# Altium schematic sheet HMI.SchDoc: Témoins et boutons
size Letter; Organization: Robocup Ulaval; DocumentNumber: 7; Revision: 1.0; SheetNumber: 7; SheetTotal: 10; Version: Gamma 1.0; Conceptor: Philippe T. Simon B. Léonard G. Alexia B-L.
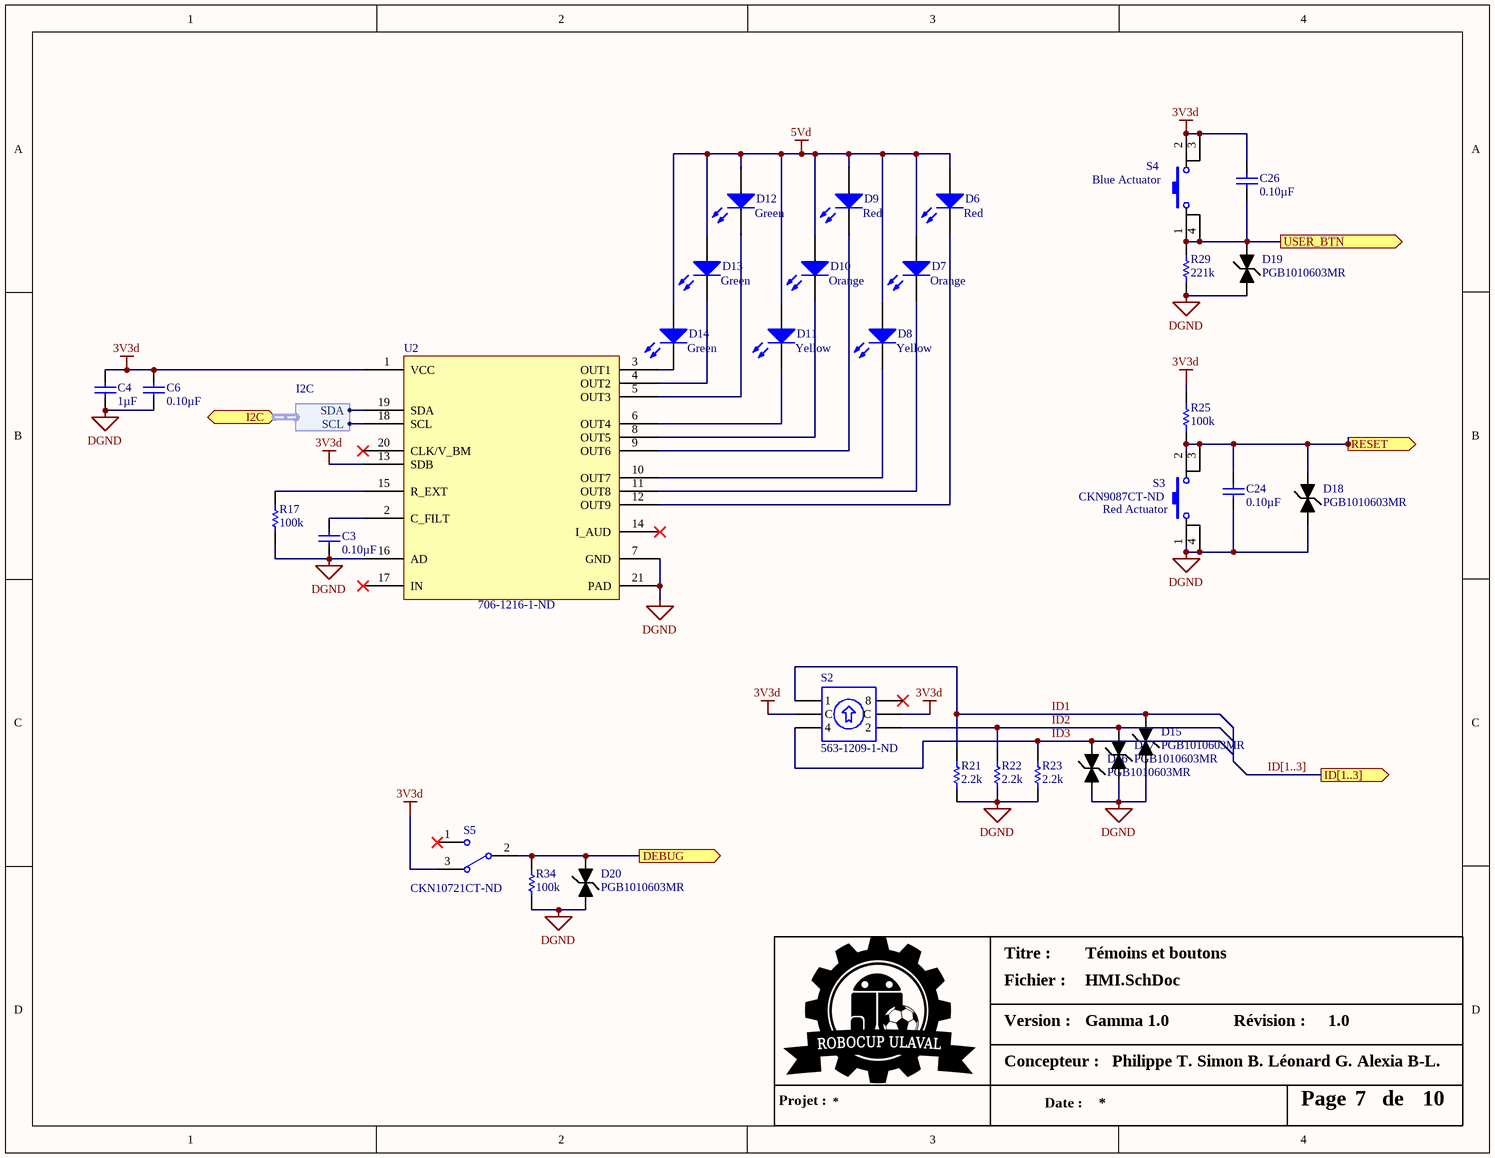
[diagram p0: HMI.SchDoc]

## Parts
C3  Capacitance: 0.10µF  [0603]  (hidden comment: CL10B104KB8SFNC)
C4  Capacitance: 1µF  [0805]  (hidden comment: CL21B105KBFNFNE)
C6  Capacitance: 0.10µF  [0603]  (hidden comment: CL10B104KB8SFNC)
C24  Capacitance: 0.10µF  [0603]  (hidden comment: CL10B104KB8SFNC)
C26  Capacitance: 0.10µF  [0603]  (hidden comment: CL10B104KB8SFNC)
D6  Color: Red  [0805]  (hidden comment: LH R974-LP-1)
D7  Color: Orange  [0805]  (hidden comment: AA1112H-TR)
D8  Color: Yellow  [0805]  (hidden comment: LY R976-PS-36)
D9  Color: Red  [0805]  (hidden comment: LH R974-LP-1)
D10  Color: Orange  [0805]  (hidden comment: AA1112H-TR)
D11  Color: Yellow  [0805]  (hidden comment: LY R976-PS-36)
D12  Color: Green  [0805]  (hidden comment: LG R971-KN-1)
D13  Color: Green  [0805]  (hidden comment: LG R971-KN-1)
D14  Color: Green  [0805]  (hidden comment: LG R971-KN-1)
D15  PGB1010603MR  [0603]
D16  PGB1010603MR  [0603]
D17  PGB1010603MR  [0603]
D18  PGB1010603MR  [0603]
D19  PGB1010603MR  [0603]
D20  PGB1010603MR  [0603]
R17  Resistance (Ohms): 100k  [0603]  (hidden comment: RC0603JR-07100KL)
R21  Resistance (Ohms): 2.2k  [0603]  (hidden comment: RC0603FR-072K2L)
R22  Resistance (Ohms): 2.2k  [0603]  (hidden comment: RC0603FR-072K2L)
R23  Resistance (Ohms): 2.2k  [0603]  (hidden comment: RC0603FR-072K2L)
R25  Resistance (Ohms): 100k  [0603]  (hidden comment: RC0603JR-07100KL)
R29  Resistance (Ohms): 221k  [0603]  (hidden comment: RC0603FR-07221KL)
R34  Resistance (Ohms): 100k  [0603]  (hidden comment: RC0603JR-07100KL)
S2  Supplier Part Number 1: 563-1209-1-ND  [RotarySwitch]  (hidden comment: SH-7010TB)
S3  Supplier Part Number 1: CKN9087CT-ND  Features: Red Actuator  [6 mm Tact Switches]  (hidden comment: PTS645SK50SMTR92 LFS)
S4  Features: Blue Actuator  [6 mm Tact Switches]  (hidden comment: PTS645SM43SMTR92 LFS)
S5  Supplier Part Number 1: CKN10721CT-ND  [SPDT-SW]  (hidden comment: JS102011JCQN)
U2  Supplier Part Number 1: 706-1216-1-ND  [QFN40P300X300X80_HS-21N]  (hidden comment: IS31FL3199-QFLS2-TR)

## Ports
DEBUG (out), I2C (harness I2C), ID[1..3] (out), RESET (out), USER_BTN (out)

## Harnesses
I2C: SCL, SDA

## Nets
3V3d: C4.2 C6.2 C26.2 R25.2 S2.2(C) S2.5(C) S4.2 S4.3 S5.3 U2.1(VCC) U2.13(SDB)
5Vd: D6.1(A) D7.1(A) D8.1(A) D9.1(A) D10.1(A) D11.1(A) D12.1(A) D13.1(A) D14.1(A)
DGND: C3.1 C4.1 C6.1 C24.1 D15.1 D16.1 D17.1 D18.1 D19.1 D20.1 R17.1 R21.1 R22.1 R23.1 R29.1 R34.1 S3.1 S3.4 U2.7(GND) U2.16(AD) U2.21(PAD)
DEBUG: D20.2 R34.2 S5.2 ; port DEBUG
ID1: D15.2 R21.2 S2.1
ID2: D17.2 R22.2 S2.4(2)
ID3: D16.2 R23.2 S2.3(4)
RESET: C24.2 D18.2 R25.1 S3.2 S3.3 ; port RESET
USER_BTN: C26.1 D19.2 R29.2 S4.1 S4.4 ; port USER_BTN
NetC3_2: C3.2 U2.2(C_FILT)
NetD6_2: D6.2(K) U2.12(OUT9)
NetD7_2: D7.2(K) U2.11(OUT8)
NetD8_2: D8.2(K) U2.10(OUT7)
NetD9_2: D9.2(K) U2.9(OUT6)
NetD10_2: D10.2(K) U2.8(OUT5)
NetD11_2: D11.2(K) U2.6(OUT4)
NetD12_2: D12.2(K) U2.5(OUT3)
NetD13_2: D13.2(K) U2.4(OUT2)
NetD14_2: D14.2(K) U2.3(OUT1)
NetR17_2: R17.2 U2.15(R_EXT)
NetU2_18: U2.18(SCL) ; port I2C.SCL
NetU2_19: U2.19(SDA) ; port I2C.SDA

Not connected (* = marked no-connect by the designer): S2 6(8)*; S5 1*; U2 14(I_AUD)* 17(IN)* 20(CLK/V_BM)*

## Buses and harness runs
bus ID[1..3] = port ID[1..3]

## Notes on the sheet
- Titre :
- Version :
- Fichier :
- Révision :
- Projet :
- Concepteur :
- Date :
- Page
- de

## Library data of the parts
C3 C6 C24 C26 = CL10B104KB8SFNC: CAP CER 0.1UF 50V X7R 0603; Manufacturer: Samsung Electro-Mechanics America, Inc.; Tolerance: ±10%; Supplier 1: Digi-Key; Manufacturer Part Number: CL10B104KB8SFNC; RoHS: RoHS Compliant; Category: Capacitors; Packaging: Cut Tape (CT); Voltage - Rated: 50V; Temperature Coefficient: X7R; Mounting Type: Surface Mount, MLCC; Operating Temperature: -55°C ~ 125°C; Applications: Boardflex Sensitive; Ratings: -; Package / Case: 0603 (1608 Metric); Size / Dimension: 0.063" L x 0.031" W (1.60mm x 0.80mm); Height - Seated (Max): -; Thickness (Max): 0.035" (0.90mm); Lead Spacing: -; Features: Soft Termination; Lead Style: -; ComponentLink1URL: http://www.samsungsem.com/kr/support/product-search/mlcc/CL10B104KB8SFNC.jsp; ComponentLink1Description: http://www.samsungsem.com/kr/support/product-search/mlcc/CL10B104KB8SFNC.jsp; Supplier Part Number 1: 445-173846-1-ND
C4 = CL21B105KBFNFNE: CAP CER 1UF 50V X7R 0805; Manufacturer: Samsung Electro-Mechanics America, Inc.; Tolerance: ±10%; Supplier 1: Digi-Key; Manufacturer Part Number: CL21B105KBFNFNE; RoHS: RoHS Compliant; Stock 1: 21699; Pricing 1: 1=0.27, 10=0.186, 25=0.14, 50=0.1072, 100=0.0884, 500=0.06238, 1000=0.05123 (CAD); Packaging: Cut Tape (CT); Voltage - Rated: 50V; Temperature Coefficient: X7R; Mounting Type: Surface Mount, MLCC; Operating Temperature: -55°C ~ 125°C; Applications: General Purpose; Ratings: -; Package / Case: 0805 (2012 Metric); Size / Dimension: 0.079" L x 0.049" W (2.00mm x 1.25mm); Height - Seated (Max): -; Thickness (Max): 0.053" (1.35mm); Lead Spacing: -; Features: -; Lead Style: -; ComponentLink1URL: http://www.samsungsem.com/kr/support/product-search/mlcc/CL21B105KBFNFNE.jsp; ComponentLink1Description: http://www.samsungsem.com/kr/support/product-search/mlcc/CL21B105KBFNFNE.jsp; Supplier Part Number 1: 1276-2928-1-ND; Category: Capacitors
D6 D9 = LH R974-LP-1: LED RED DIFFUSED 0805 SMD; Manufacturer: OSRAM Opto Semiconductors Inc.; Lens Color: White; Millicandela Rating: 41mcd; Lens Style/Size: Rectangle with Flat Top, 1.30mm x 1.25mm; Voltage - Forward (Vf) (Typ): 1.8V; Current - Test: 20mA; Viewing Angle: 160°; Wavelength - Dominant: 645nm; Wavelength - Peak: 660nm; Supplier 1: Digi-Key; Manufacturer Part Number: LH R974-LP-1; RoHS: RoHS Compliant; Category: Optoelectronics; Stock 1: 124060; Pricing 1: 1=0.37, 10=0.267, 25=0.1972, 100=0.141, 250=0.09588, 500=0.0846, 1000=0.06626 (CAD); Packaging: Cut Tape (CT); Lens Transparency: Diffused; Mounting Type: Surface Mount; Features: -; Package / Case: 0805 (2012 Metric); Supplier Device Package: *; Size / Dimension: 2.00mm L x 1.25mm W; Height (Max): 0.90mm; ComponentLink1URL: http://www.osram-os.com/Graphics/XPic8/00078869_0.pdf; ComponentLink1Description: http://www.osram-os.com/Graphics/XPic8/00078869_0.pdf; Supplier Part Number 1: 475-1415-1-ND
D7 D10 = AA1112H-TR: LED ORANGE DIFFUSED 0805 SMD; Manufacturer: Stanley Electric Co; Lens Color: White; Millicandela Rating: 3.7mcd; Lens Style/Size: Rectangle with Flat Top, 1.20mm x 1.25mm; Voltage - Forward (Vf) (Typ): 2.2V; Current - Test: 20mA; Viewing Angle: 153°, 154°; Wavelength - Dominant: 606nm; Wavelength - Peak: 605nm; Supplier 1: Digi-Key; Manufacturer Part Number: AA1112H-TR; RoHS: RoHS Compliant; Category: Optoelectronics; Stock 1: 7828; Pricing 1: 1=0.65, 10=0.458, 25=0.3752, 100=0.3003, 250=0.2252, 1000=0.16379 (CAD); Packaging: Cut Tape (CT); Lens Transparency: Diffused; Mounting Type: Surface Mount; Features: -; Package / Case: 0805 (2012 Metric); Supplier Device Package: 2125; Size / Dimension: 2.00mm L x 1.25mm W; Height (Max): 0.90mm; ComponentLink1URL: http://media.digikey.com/pdf/Data%20Sheets/Stanley%20Electric%20PDFs/BR1112H.pdf; ComponentLink1Description: http://media.digikey.com/pdf/Data%20Sheets/Stanley%20Electric%20PDFs/BR1112H.pdf; Supplier Part Number 1: 404-1018-1-ND
D8 D11 = LY R976-PS-36: LED YELLOW DIFFUSED 0805 SMD; Manufacturer: OSRAM Opto Semiconductors Inc.; Lens Color: White; Millicandela Rating: 162.5mcd; Lens Style/Size: Rectangle with Flat Top, 1.30mm x 1.25mm; Voltage - Forward (Vf) (Typ): 2V; Current - Test: 20mA; Viewing Angle: 160°; Wavelength - Dominant: 588nm; Wavelength - Peak: 591nm; Supplier 1: Digi-Key; Manufacturer Part Number: LY R976-PS-36; RoHS: RoHS Compliant; Category: Optoelectronics; Stock 1: 102790; Pricing 1: 1=0.38, 10=0.282, 25=0.2076, 100=0.1484, 250=0.10088, 500=0.08904, 1000=0.06974 (CAD); Packaging: Cut Tape (CT); Lens Transparency: Diffused; Mounting Type: Surface Mount; Features: -; Package / Case: 0805 (2012 Metric); Supplier Device Package: 0805; Size / Dimension: 2.00mm L x 1.25mm W; Height (Max): 0.90mm; ComponentLink1URL: http://www.osram-os.com/Graphics/XPic9/00078941_0.pdf; ComponentLink1Description: http://www.osram-os.com/Graphics/XPic9/00078941_0.pdf; Supplier Part Number 1: 475-2560-1-ND
D12-D14 = LG R971-KN-1: LED GREEN DIFFUSED 0805 SMD; Manufacturer: OSRAM Opto Semiconductors Inc.; Lens Color: White; Millicandela Rating: 26.05mcd; Lens Style/Size: Rectangle with Flat Top, 1.30mm x 1.25mm; Voltage - Forward (Vf) (Typ): 2.2V; Current - Test: 20mA; Viewing Angle: 160°; Wavelength - Dominant: 570nm; Wavelength - Peak: 572nm; Supplier 1: Digi-Key; Manufacturer Part Number: LG R971-KN-1; RoHS: RoHS Compliant; Category: Optoelectronics; Stock 1: 315869; Pricing 1: 1=0.37, 10=0.267, 25=0.1972, 100=0.141, 250=0.09588, 500=0.0846, 1000=0.06626 (CAD); Packaging: Cut Tape (CT); Lens Transparency: Diffused; Mounting Type: Surface Mount; Features: -; Package / Case: 0805 (2012 Metric); Supplier Device Package: *; Size / Dimension: 2.00mm L x 1.25mm W; Height (Max): 0.90mm; ComponentLink1URL: http://www.osram-os.com/Graphics/XPic9/00078860_0.pdf; ComponentLink1Description: http://www.osram-os.com/Graphics/XPic9/00078860_0.pdf; Supplier Part Number 1: 475-1410-1-ND
D15-D20 = PGB1010603MR: TVS DIODE 24VWM 150VC 0603; Supplier 1: Digi-Key; Supplier Part Number 1: F2594TR-ND
R17 R25 R34 = RC0603JR-07100KL: RES SMD 100K OHM 5% 1/10W 0603; Manufacturer: Yageo; Power (Watts): 0.1W, 1/10W; Temperature Coefficient: ±100ppm/°C; Supplier 1: Digi-Key; Manufacturer Part Number: RC0603JR-07100KL; RoHS: RoHS Compliant; Category: Resistors; Stock 1: 2803334; Pricing 1: 1=0.15, 10=0.017, 25=0.012, 100=0.0067, 250=0.00508, 500=0.00408, 1000=0.003, 2500=0.0026 (CAD); Packaging: Cut Tape (CT); Tolerance: ±5%; Composition: Thick Film; Features: Moisture Resistant; Operating Temperature: -55°C ~ 155°C; Package / Case: 0603 (1608 Metric); Supplier Device Package: 0603; Size / Dimension: 0.063" L x 0.031" W (1.60mm x 0.80mm); Height: 0.022" (0.55mm); Number of Terminations: 2; ComponentLink1URL: http://www.yageo.com/documents/recent/PYu-RC_Group_51_RoHS_L_04.pdf; ComponentLink1Description: http://www.yageo.com/documents/recent/PYu-RC_Group_51_RoHS_L_04.pdf; Supplier Part Number 1: 311-100KGRCT-ND
R21-R23 = RC0603FR-072K2L: RES SMD 2.2K OHM 1% 1/10W 0603; Manufacturer: Yageo; Power (Watts): 0.1W, 1/10W; Temperature Coefficient: ±100ppm/°C; Supplier 1: Digi-Key; Manufacturer Part Number: RC0603FR-072K2L; RoHS: RoHS Compliant; Category: Resistors; Stock 1: 297758; Pricing 1: 1=0.15, 10=0.021, 25=0.0152, 100=0.0086, 250=0.0066, 500=0.00526, 1000=0.00389, 2500=0.00337 (CAD); Packaging: Cut Tape (CT); Tolerance: ±1%; Composition: Thick Film; Features: Moisture Resistant; Operating Temperature: -55°C ~ 155°C; Package / Case: 0603 (1608 Metric); Supplier Device Package: 0603; Size / Dimension: 0.063" L x 0.031" W (1.60mm x 0.80mm); Height: 0.022" (0.55mm); Number of Terminations: 2; ComponentLink1URL: http://www.yageo.com/documents/recent/PYu-RC_Group_51_RoHS_L_04.pdf; ComponentLink1Description: http://www.yageo.com/documents/recent/PYu-RC_Group_51_RoHS_L_04.pdf; Supplier Part Number 1: 311-2.20KHRCT-ND
R29 = RC0603FR-07221KL: RES SMD 221K OHM 1% 1/10W 0603; Manufacturer: Yageo; Power (Watts): 0.1W, 1/10W; Temperature Coefficient: ±100ppm/°C; Supplier 1: Digi-Key; Manufacturer Part Number: RC0603FR-07221KL; RoHS: RoHS Compliant; Category: Resistors; Stock 1: 288409; Pricing 1: 1=0.15, 10=0.021, 25=0.0152, 100=0.0086, 250=0.0066, 500=0.00526, 1000=0.00389, 2500=0.00337 (CAD); Packaging: Cut Tape (CT); Tolerance: ±1%; Composition: Thick Film; Features: Moisture Resistant; Operating Temperature: -55°C ~ 155°C; Package / Case: 0603 (1608 Metric); Supplier Device Package: 0603; Size / Dimension: 0.063" L x 0.031" W (1.60mm x 0.80mm); Height: 0.022" (0.55mm); Number of Terminations: 2; ComponentLink1URL: http://www.yageo.com/documents/recent/PYu-RC_Group_51_RoHS_L_04.pdf; ComponentLink1Description: http://www.yageo.com/documents/recent/PYu-RC_Group_51_RoHS_L_04.pdf; Supplier Part Number 1: 311-221KHRCT-ND
S2 = SH-7010TB: SWITCH ROTARY DIP BCD 100MA 5V; Manufacturer: Copal Electronics Inc.; Number of Positions: 10; Voltage Rating: 5VDC; Actuator Type: Rotary for Tool; Actuator Level: Flush, Recessed; Pitch: 0.100" (2.54mm), Full; Washable: Yes; Body Material: Polyphenylene Sulfide (PPS); Electrical Life: 10,000 Steps; Supplier 1: Digi-Key; Manufacturer Part Number: SH-7010TB; RoHS: RoHS Compliant; Category: Switches; Stock 1: 18527; Pricing 1: 1=2.91, 10=2.798, 25=2.554, 50=2.4326, 100=2.1893, 250=2.00688 (CAD); Packaging: Cut Tape (CT); Circuit: BCD; Current Rating: 100mA; Contact Material: Copper Alloy; Contact Finish: Gold; Height Above Board: 0.148" (3.75mm); Mounting Type: Surface Mount; Termination Style: Gull Wing; Features: -; Length: 0.287" (7.30mm); Operating Temperature: -40°C ~ 85°C; Mechanical Life: -; ComponentLink1URL: http://www.nidec-copal-electronics.com/e/catalog/switch/sh-7000.pdf; ComponentLink1Description: http://www.nidec-copal-electronics.com/e/catalog/switch/sh-7000.pdf
S3 = PTS645SK50SMTR92 LFS: SWITCH TACTILE SPST-NO 0.05A 12V; Manufacturer: C&K Components; Switch Function: Off-Mom; Contact Rating @ Voltage: 0.05A @ 12VDC; Actuator Type: Standard; Actuator Height off PCB, from Pins: 5.00mm; Actuator Orientation: Top Actuated; Outline: 6.00mm x 6.00mm; Illumination: Non-Illuminated; Operating Force: 260gf; Actuator Material: Polyamide (PA66), Nylon 6/6; Mechanical Life: 100,000 Cycles; Supplier 1: Digi-Key; Manufacturer Part Number: PTS645SK50SMTR92 LFS; RoHS: RoHS Compliant; Category: Switches; Stock 1: 73782; Pricing 1: 1=0.38, 10=0.362, 25=0.35, 50=0.3374, 100=0.3186, 250=0.29976, 500=0.2873 (CAD); Packaging: Cut Tape (CT); Circuit: SPST-NO; Mounting Type: Surface Mount; Termination Style: Gull Wing; Illumination Voltage (Nominal): -; Illumination Type, Color: -; Ingress Protection: -; Switch Travel: -; Operating Temperature: -20°C ~ 60°C; ComponentLink1URL: http://media.digikey.com/pdf/Data%20Sheets/C&K/PTS645_Series.pdf; ComponentLink1Description: http://media.digikey.com/pdf/Data%20Sheets/C&K/PTS645_Series.pdf
S4 = PTS645SM43SMTR92 LFS: SWITCH TACTILE SPST-NO 0.05A 12V; Manufacturer: C&K Components; Switch Function: Off-Mom; Contact Rating @ Voltage: 0.05A @ 12VDC; Actuator Type: Standard; Actuator Height off PCB, from Pins: 4.30mm; Actuator Orientation: Top Actuated; Outline: 6.00mm x 6.00mm; Illumination: Non-Illuminated; Operating Force: 160gf; Actuator Material: Polyamide (PA66), Nylon 6/6; Mechanical Life: 100,000 Cycles; Supplier 1: Digi-Key; Supplier Part Number 1: CKN9112CT-ND; Manufacturer Part Number: PTS645SM43SMTR92 LFS; RoHS: RoHS Compliant; Category: Switches; Stock 1: 189506; Pricing 1: 1=0.44, 10=0.425, 25=0.4108, 50=0.3958, 100=0.3737, 250=0.35176, 500=0.33708 (CAD); Packaging: Cut Tape (CT); Circuit: SPST-NO; Mounting Type: Surface Mount; Termination Style: Gull Wing; Illumination Voltage (Nominal): -; Illumination Type, Color: -; Ingress Protection: -; Switch Travel: -; Operating Temperature: -20°C ~ 60°C; ComponentLink1URL: http://media.digikey.com/pdf/Data%20Sheets/C&K/PTS645_Series.pdf; ComponentLink1Description: http://media.digikey.com/pdf/Data%20Sheets/C&K/PTS645_Series.pdf
S5 = JS102011JCQN: SWITCH SLIDE SPDT 300MA 6V; Manufacturer: C&K Components; Contact Timing: Not Specified; Switch Function: On-On; Current Rating: 300mA (DC); Actuator Type: Standard; Actuator Length: 2.00mm; Actuator Material: Polyamide (PA46), Nylon 4/6; Electrical Life: 5,000 Cycles; Supplier 1: Digi-Key; Manufacturer Part Number: JS102011JCQN; RoHS: RoHS Compliant; Category: Switches; Stock 1: 1803; Pricing 1: 1=0.9, 10=0.873, 25=0.8544, 50=0.7636, 100=0.7272, 250=0.70896, 500=0.59992 (CAD); Packaging: Cut Tape (CT); Part Status: Active; Circuit: SPDT; Voltage Rating - AC: -; Voltage Rating - DC: 6V; Contact Material: Copper Alloy; Contact Finish: Silver; Mounting Type: Surface Mount; Termination Style: J Lead; Features: -; Switch Travel: 2.00mm; Operating Temperature: -40°C ~ 85°C; Mechanical Life: -; Operating Force: -; ComponentLink1URL: http://www.ck-components.com/media/1422/js.pdf; ComponentLink1Description: http://www.ck-components.com/media/1422/js.pdf
U2 = IS31FL3199-QFLS2-TR: IC LED DRIVER LIN DIM 40MA 20QFN; Manufacturer: ISSI, Integrated Silicon Solution Inc; Internal Switch(s): Yes; Number of Outputs: 9; Voltage - Supply (Min): 2.7V; Voltage - Supply (Max): 5.5V; Dimming: PWM; Supplier 1: Digi-Key; Manufacturer Part Number: IS31FL3199-QFLS2-TR; RoHS: RoHS Compliant; Category: Integrated Circuits (ICs); Stock 1: 2174; Pricing 1: 1=2.4, 10=2.134, 25=1.9272, 100=1.6863, 250=1.4798, 500=1.30778, 1000=1.03244 (CAD); Packaging: Cut Tape (CT); Type: Linear; Topology: -; Voltage - Output: -; Current - Output / Channel: 40mA; Frequency: -; Applications: -; Operating Temperature: -40°C ~ 85°C (TA); Mounting Type: Surface Mount; Package / Case: 20-VFQFN Exposed Pad; Supplier Device Package: 20-QFN (3x3); ComponentLink1URL: http://www.issi.com/WW/pdf/31FL3199.pdf; ComponentLink1Description: http://www.issi.com/WW/pdf/31FL3199.pdf